# EAGLE design bldc_drv_L293_v31 (EAGLE 6.4)
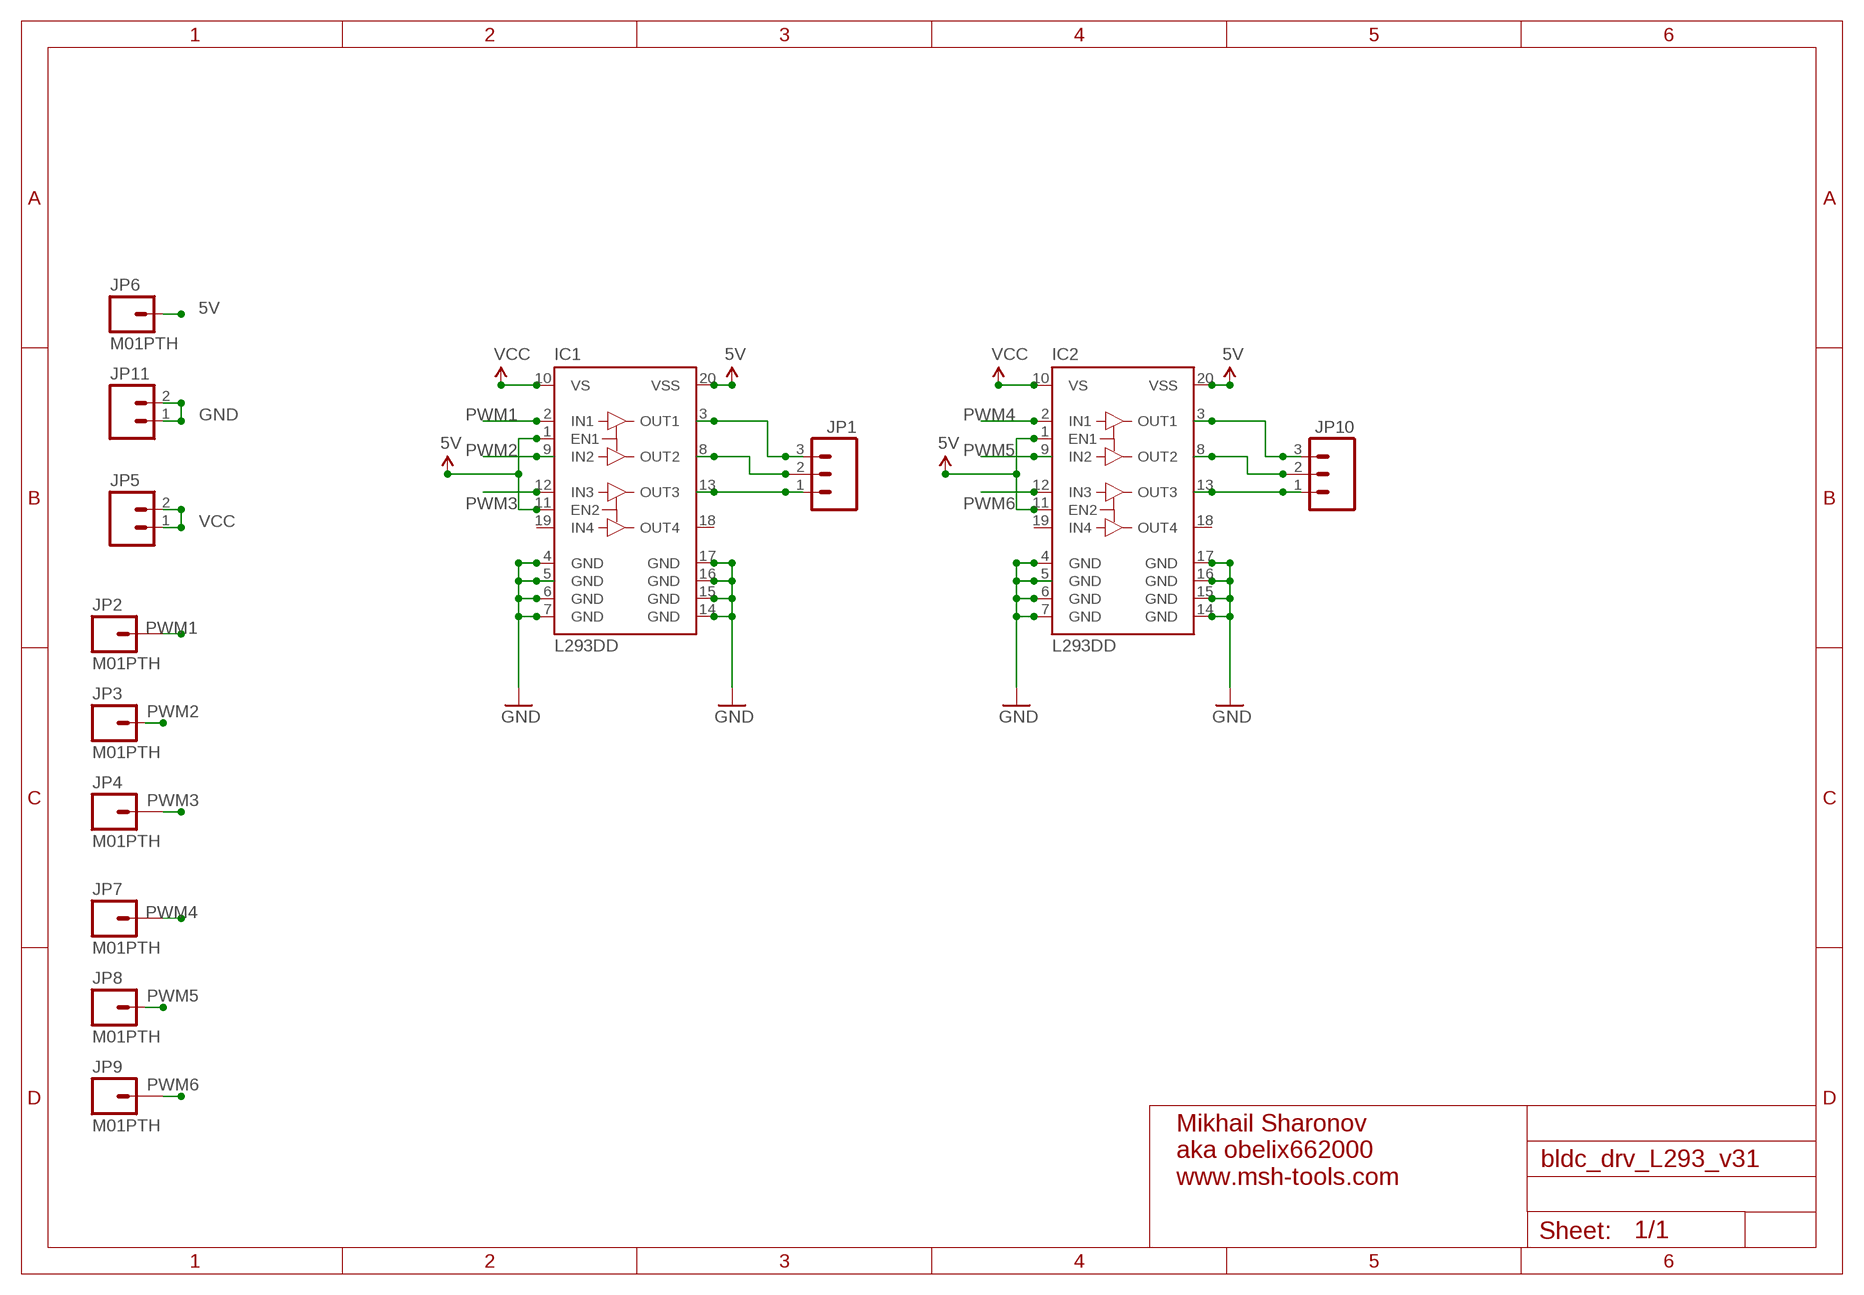
[diagram p0: schematic, sheet 1]

## Parts
IC1  L293DD  [SO20]
IC2  L293DD  [SO20]
JP1  M03PTH  [1X03]
JP2  M01PTH  [1X01]
JP3  M01PTH  [1X01]
JP4  M01PTH  [1X01]
JP5  M02PTH  [1X02]
JP6  M01PTH  [1X01]
JP7  M01PTH  [1X01]
JP8  M01PTH  [1X01]
JP9  M01PTH  [1X01]
JP10  M03PTH  [1X03]
JP11  M02PTH  [1X02]

## Nets
5V: IC1.1(EN1) IC1.11(EN2) IC1.20(VSS) IC2.1(EN1) IC2.11(EN2) IC2.20(VSS) JP6.1
GND: IC1.4(GND) IC1.5(GND) IC1.6(GND) IC1.7(GND) IC1.14(GND) IC1.15(GND) IC1.16(GND) IC1.17(GND) IC2.4(GND) IC2.5(GND) IC2.6(GND) IC2.7(GND) IC2.14(GND) IC2.15(GND) IC2.16(GND) IC2.17(GND) JP11.1 JP11.2
N$1: IC2.3(OUT1) JP10.3
N$2: IC1.3(OUT1) JP1.3
N$3: IC1.8(OUT2) JP1.2
N$4: IC1.13(OUT3) JP1.1
N$5: IC2.8(OUT2) JP10.2
N$6: IC2.13(OUT3) JP10.1
PWM1: IC1.2(IN1) JP2.1
PWM2: IC1.9(IN2) JP3.1
PWM3: IC1.12(IN3) JP4.1
PWM4: IC2.2(IN1) JP7.1
PWM5: IC2.9(IN2) JP8.1
PWM6: IC2.12(IN3) JP9.1
VCC: IC1.10(VS) IC2.10(VS) JP5.1 JP5.2
Unconnected: IC1.18(OUT4) IC1.19(IN4) IC2.18(OUT4) IC2.19(IN4)

## Notes on the sheet
- Mikhail Sharonov
  aka obelix662000
  www.msh-tools.com

## Library data of the parts
IC1 IC2 = st-microelectronics:L293DD: PUSH-PULL FOUR CHANNEL DRIVER WITH DIODES Source: http://www.st.com/stonline/books/pdf/docs/1330.pdf; OC_FARNELL: unknown
JP1 JP10 = SparkFun-Connectors:M03: Header 3 Standard 3-pin 0.1" header. Use with straight break away headers (SKU : PRT-00116), right angle break away headers (PRT-00553), swiss pins (PRT-00743), machine pins (PRT-00117), and female headers (PRT-00115). Molex polarized connector foot print use with SKU : PRT-08232 with associated crimp pins and housings.
JP2-JP4 JP6-JP9 = SparkFun-Connectors:M01: Header 1 Standard 1-pin 0.1" header. Use with straight break away headers (SKU : PRT-00116), right angle break away headers (PRT-00553), swiss pins (PRT-00743), machine pins (PRT-00117), and female headers (PRT-00115).
JP5 JP11 = SparkFun-Connectors:M02: Header 2 Standard 2-pin 0.1" header. Use with straight break away headers (SKU : PRT-00116), right angle break away headers (PRT-00553), swiss pins (PRT-00743), machine pins (PRT-00117), and female headers (PRT-00115). Molex polarized connector foot print use with SKU : PRT-08233 with associated crimp pins and housings.

## Board
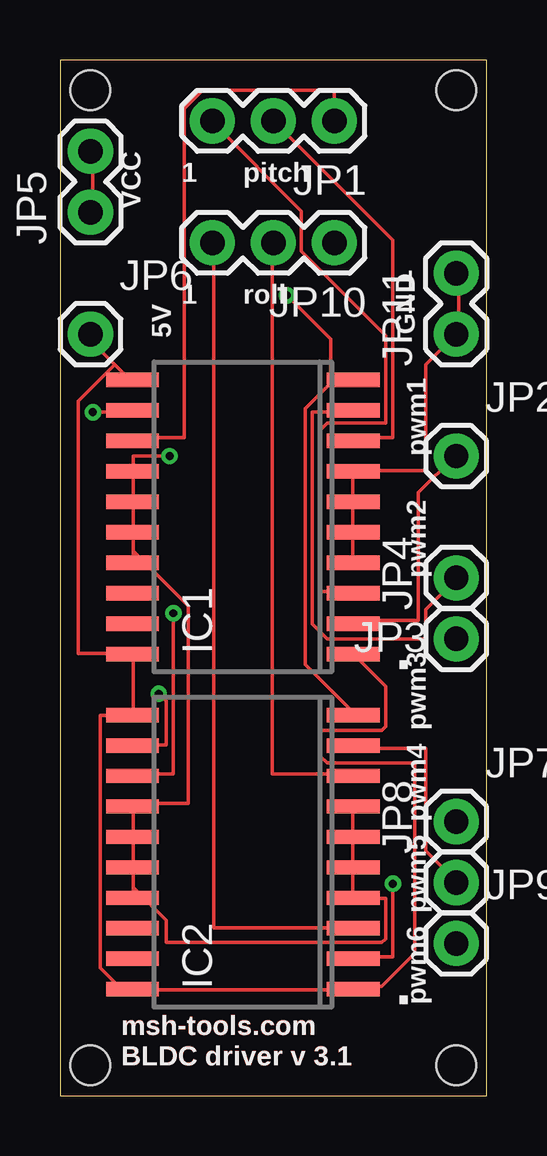
[diagram p1: board, top side]
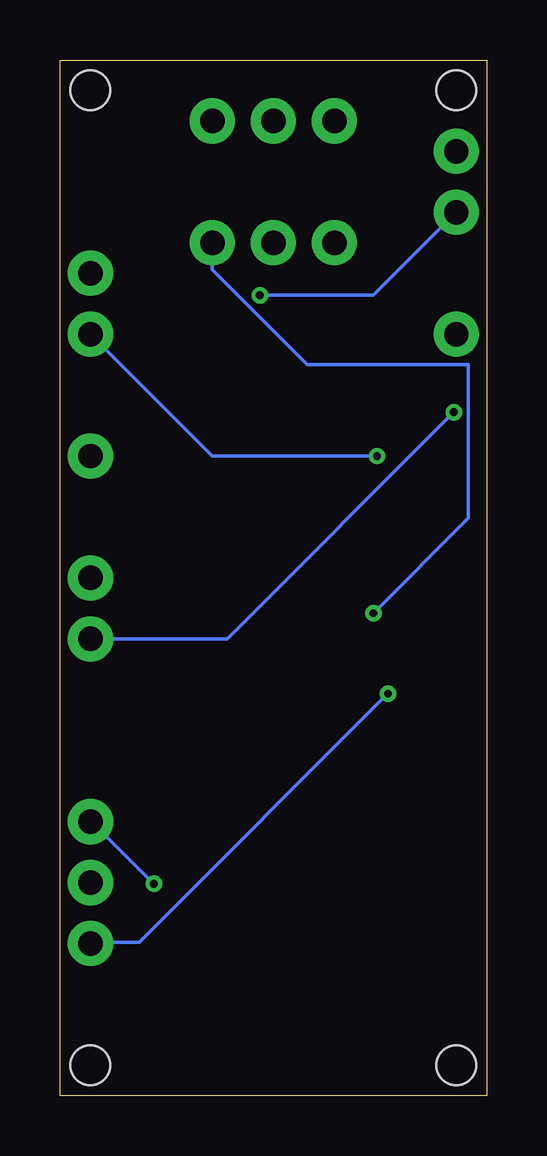
[diagram p2: board, bottom side, seen from below]

Size 17.78 x 43.18 mm. Coordinates in mm from the lower left corner, seen from the top.
Outline: 0,0 17.78,0 17.78,43.18 0,43.17 0,0
Copper layers (1*16): Top 0.0356mm / dielectric 1.5011mm / Bottom 0.0356mm
Design rules "LaenPCBOrder *": minimum track width 6mil, minimum drill 13mil, track to track 6mil, track to pad 6mil, pad to pad 6mil, via to via 6mil, smd to smd 6mil, copper to edge 15mil, drill to drill 6mil, minimum pad ring 7mil, minimum via ring 7mil, stop-mask expansion 4mil, vias tented up to drill 20mil, thermal gap 10mil
Holes 1.65 mm at 1.27,41.91 16.51,41.91 16.51,1.27 1.27,1.27

### Footprints (pad centres in the part's own frame; a part is rotated, then mirrored left to right if it is on the bottom)
SO20 = smd 0.6 x 2.2: 1 -5.715,-4.6; 2 -4.445,-4.6; 3 -3.175,-4.6; 4 -1.905,-4.6; 5 -0.635,-4.6; 6 0.635,-4.6; 7 1.905,-4.6; 8 3.175,-4.6; 9 4.445,-4.6; 10 5.715,-4.6; 11 5.715,4.6; 12 4.445,4.6; 13 3.175,4.6; 14 1.905,4.6; 15 0.635,4.6; 16 -0.635,4.6; 17 -1.905,4.6; 18 -3.175,4.6; 19 -4.445,4.6; 20 -5.715,4.6
1X03 = drill 1.016 pad 1.88: 1 0,0; 2 2.54,0; 3 5.08,0
1X01 = drill 1.016 pad 1.88: 1 0,0
1X02 = drill 1.016 pad 1.88: 1 0,0; 2 2.54,0

### Placement (x,y rotation side)
IC1  7.62,24.13 90 top
IC2  7.62,10.16 90 top
JP1  11.43,40.64 180 top
JP2  16.51,26.67 0 top
JP3  16.51,21.59 180 top
JP4  16.51,19.05 90 top
JP5  1.27,36.83 90 top
JP6  1.27,31.75 0 top
JP7  16.51,11.43 0 top
JP8  16.51,8.89 90 top
JP9  16.51,6.35 0 top
JP10  11.43,35.56 180 top
JP11  16.51,31.75 90 top

### Tracks (layer width: path | path; a pad name or v marks a point on that pad's centre or on a via)
5V
  Top 0.152: 2.29,30.48 1.37,31.39 1.37,31.7 JP6.1 | 2.29,30.48 2.9,29.87 IC1.11 | 2.29,30.48 0.76,28.96 0.76,18.44 2.9,18.44 IC1.20 3.05,18.29 3.05,16 IC2.11 2.9,15.85 1.68,15.85 1.68,5.33 2.44,4.57 2.9,4.57 IC2.20 3.05,4.42 12.19,4.42 IC2.1 12.34,4.57 13.41,4.57 14.78,5.94 14.78,13.87 11.12,13.87 10.82,14.17 10.82,15.24 13.41,15.24 13.56,15.39 13.56,17.07 12.34,18.29 IC1.1
GND  (via drill 0.33)
  Top 0.152: IC1.4 12.19,22.25 12.19,23.47 IC1.5 12.19,23.62 12.19,24.69 IC1.6 12.19,24.84 12.19,25.91 IC1.7 12.34,26.06 15.24,26.06 15.24,30.48 JP11.1 16.61,31.85 16.61,34.29 JP11.2 | 12.19,8.23 IC2.4 | IC2.4 12.19,8.38 12.19,9.45 IC2.5 12.19,9.6 12.19,10.67 IC2.6 12.19,10.82 12.19,12.04 IC2.7 | 3.05,8.23 IC2.17 3.05,8.38 3.05,8.69 | 3.05,8.69 3.05,9.45 IC2.16 3.05,9.6 3.05,10.67 IC2.15 3.05,10.82 3.05,12.04 IC2.14 3.05,12.19 5.33,12.19 5.33,20.42 3.05,22.71 | 3.05,22.71 3.05,23.47 IC1.16 3.05,23.62 3.05,24.69 IC1.15 3.05,24.84 3.05,25.91 IC1.14 3.05,26.06 3.05,26.67 v4.57,26.67 | 3.05,22.71 3.05,22.25 IC1.17 | 3.05,8.69 4.42,7.32 4.42,6.4 13.41,6.4 13.56,6.55 13.56,8.23 12.34,8.23 IC2.4
  Bottom 0.152: JP11.1 11.43,26.67 v4.57,26.67
N$1
  Top 0.152: IC2.3 12.19,7.01 6.4,7.01 6.4,35.51 JP10.3
N$2
  Top 0.152: IC1.3 12.19,21.03 10.82,21.03 10.82,27.74 11.12,28.04 13.56,28.04 13.56,31.7 10.06,35.2 10.06,36.88 6.4,40.54 JP1.3
N$3
  Top 0.152: JP1.2 13.87,35.66 13.87,27.43 12.34,27.43 IC1.8
N$4
  Top 0.152: JP1.1 11.43,41.91 5.94,41.91 5.18,41.15 5.18,27.43 3.05,27.43 IC1.13
N$5
  Top 0.152: IC2.8 12.19,13.41 8.84,13.41 8.84,35.51 JP10.2
N$6  (via drill 0.33)
  Top 0.152: v4.72,20.12 4.72,13.41 3.05,13.41 IC2.13
  Bottom 0.152: v4.72,20.12 0.76,24.08 0.76,30.48 7.47,30.48 11.43,34.44 JP10.1
PWM1
  Top 0.152: IC1.2 12.34,19.81 14.94,19.81 14.94,25.15 16.46,26.67 JP2.1
PWM2
  Top 0.152: IC1.9 12.19,28.5 10.52,28.5 10.52,19.66 11.12,19.05 15.24,19.05 15.24,20.27 16.46,21.49 JP3.1
PWM3  (via drill 0.33)
  Top 0.152: v1.37,28.5 2.9,28.5 IC1.12
  Bottom 0.152: v1.37,28.5 10.82,19.05 JP4.1
PWM4  (via drill 0.33)
  Top 0.152: v13.87,8.84 13.87,5.79 12.34,5.79 IC2.2
  Bottom 0.152: v13.87,8.84 16.46,11.43 JP7.1
PWM5
  Top 0.152: IC2.9 12.34,14.48 15.24,14.48 15.24,10.21 16.46,8.99 JP8.1
PWM6  (via drill 0.33)
  Top 0.152: v4.12,16.76 4.42,16.46 4.42,14.63 3.05,14.63 IC2.12
  Bottom 0.152: v4.12,16.76 14.48,6.4 16.46,6.4 JP9.1
VCC  (via drill 0.33)
  Top 0.152: JP5.1 1.37,36.88 1.37,39.32 JP5.2 | 11.28,29.72 10.21,28.65 10.21,17.98 12.19,16 IC2.10 | 11.28,29.72 12.19,29.72 IC1.10 11.28,29.72 | v9.45,33.38 11.28,31.55 11.28,29.72
  Bottom 0.152: JP5.1 4.72,33.38 v9.45,33.38

### Text on the board
Top: msh-tools.com | msh-tools.com | BLDC driver v 3.1
tPlace: VCC | 1 | pitch | GND | 5V | 1 | roll | pwm1 | pwm2 | . | pwm3 | pwm4 | pwm5 | . | pwm6 | msh-tools.com | BLDC driver v 3.1
_tNames: JP5 | C2 | C5 | JP11 | JP2 | JP6 | JP4 | JP3 | C4 | U$2 | C6 | JP1 | JP7 | JP8 | JP9 | C1 | C3 | U$1